# Altium schematic sheet CAN_Node.SchDoc
size A3; Author: TIMOTHY WARNOCK; CompanyName: CURTIN MOTORSPORT TEAM; DrawnBy: TIMOTHY WARNOCK; Engineer: TIMOTHY WARNOCK; Revision: 1; SheetNumber: 1; SheetTotal: 1
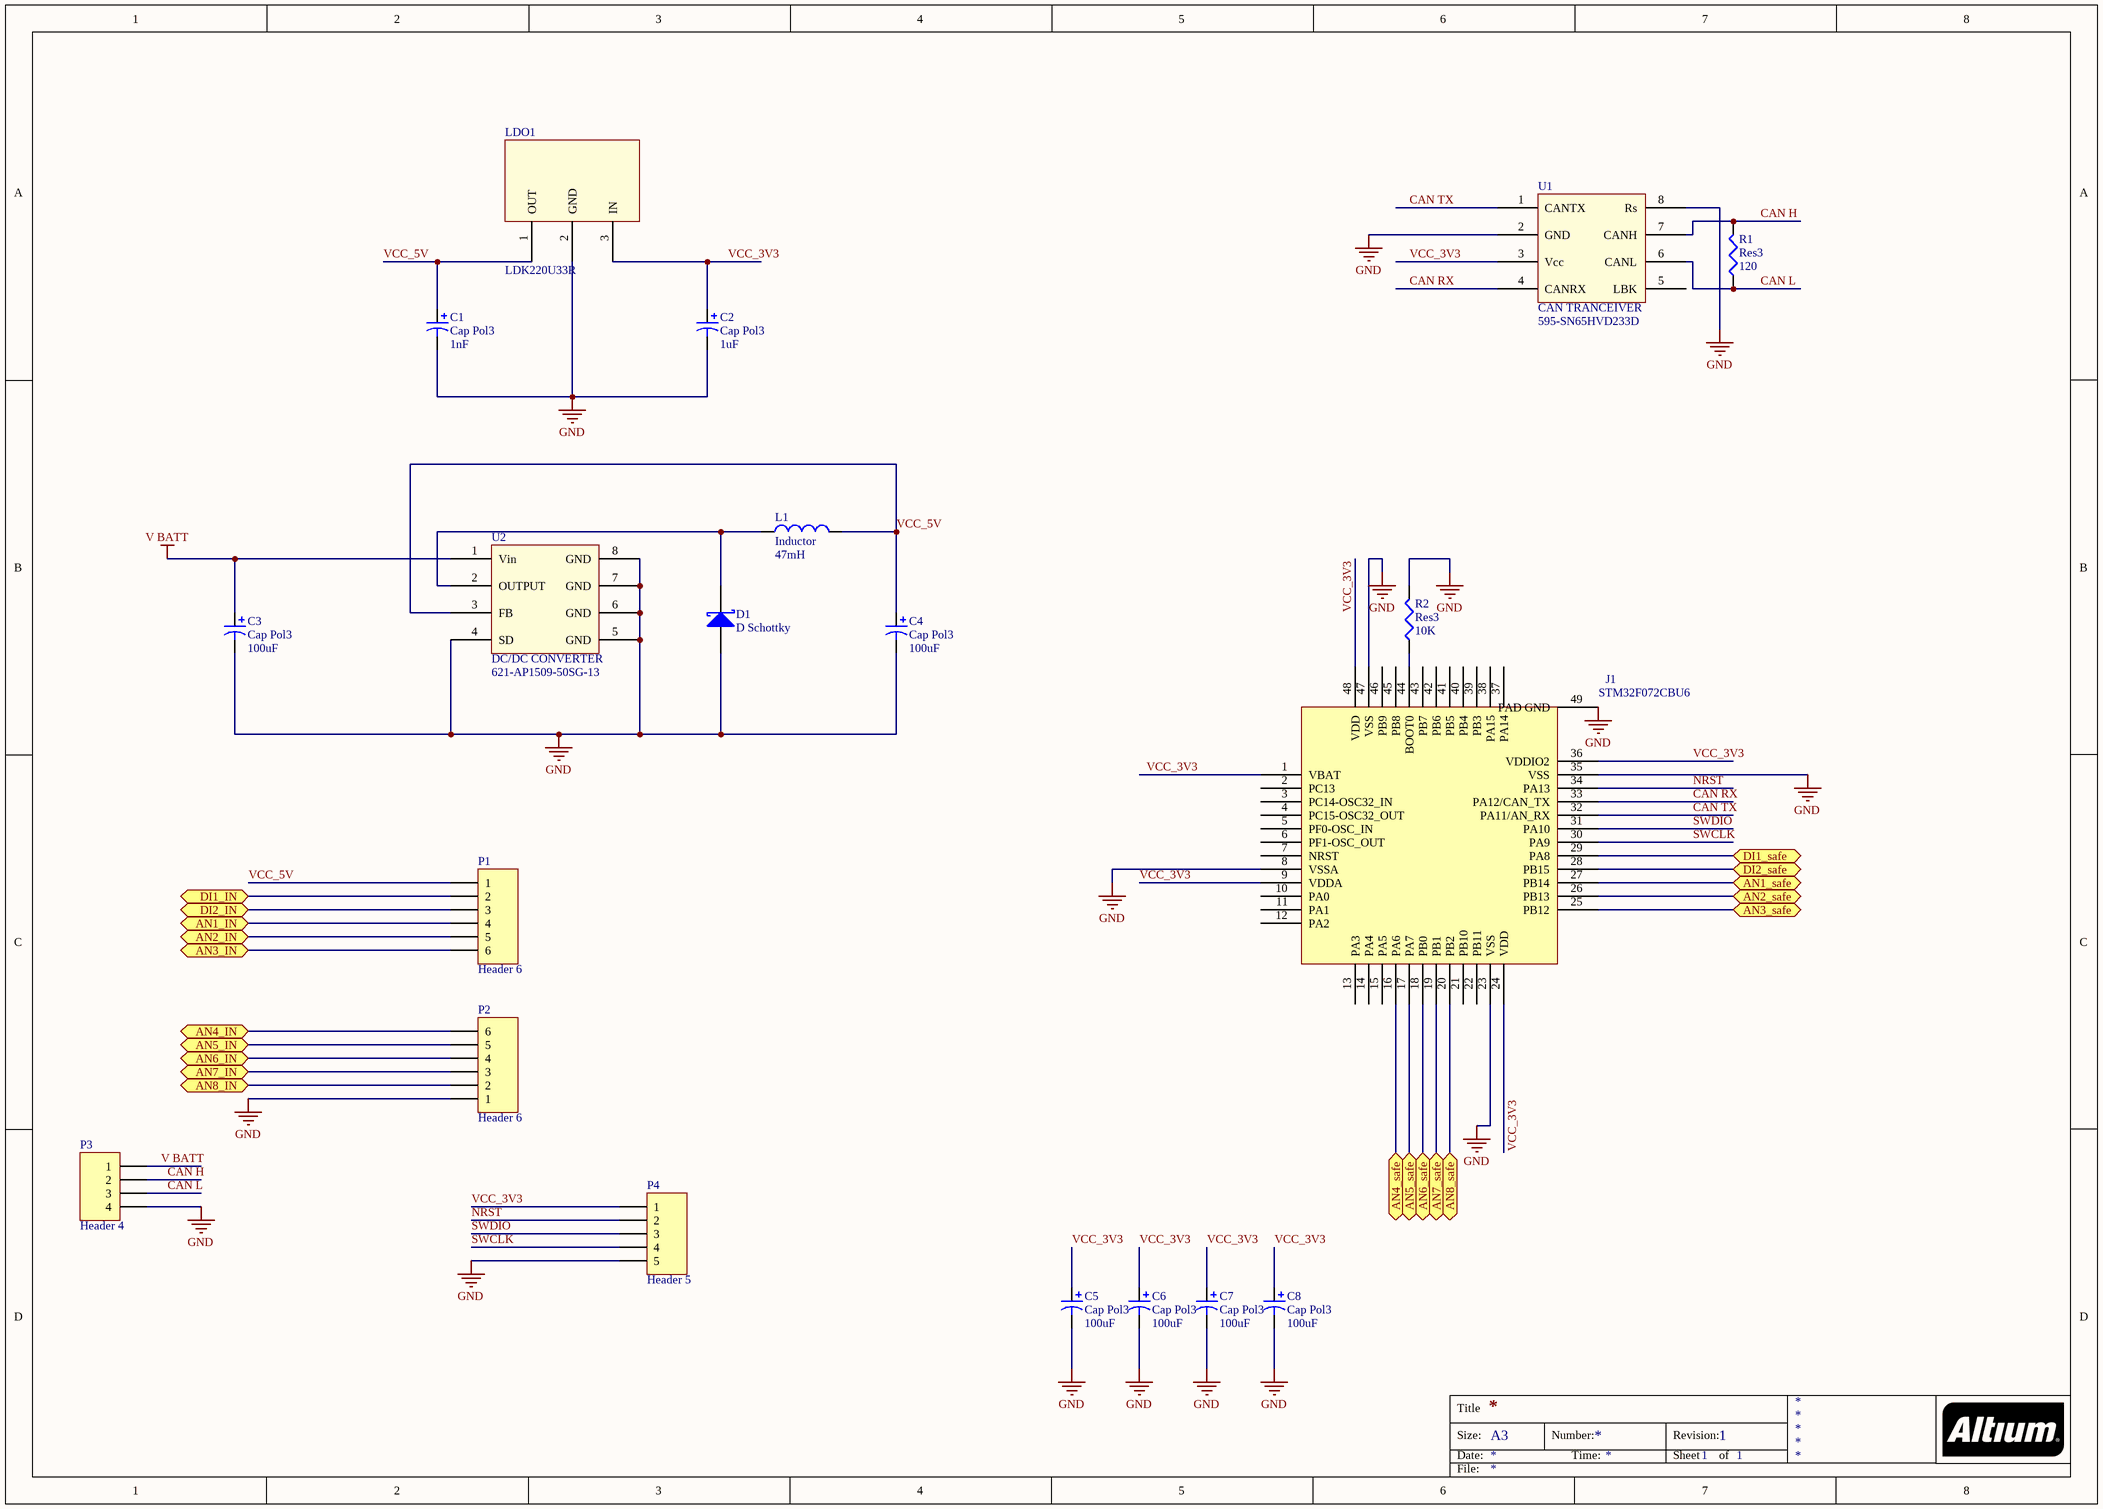
[diagram p0: CAN_Node.SchDoc]

## Parts
C1  Cap Pol3  value 1nF  [C0805]
C2  Cap Pol3  value 1uF  [C0805]
C3  Cap Pol3  value 100uF  [C0805]
C4  Cap Pol3  value 100uF  [C0805]
C5  Cap Pol3  value 100uF  [C0805]
C6  Cap Pol3  value 100uF  [C0805]
C7  Cap Pol3  value 100uF  [C0805]
C8  Cap Pol3  value 100uF  [C0805]
D1  D Schottky  [SMB]
J1  STM32F072CBU6  [STM32F072CBU6]
L1  Inductor  value 47mH  [0402-A]
LDO1  LDK220U33R  [SOT89-157P409X160-3N]
P1  Header 6  [HDR1X6]
P2  Header 6  [HDR1X6]
P3  Header 4  [HDR1X4]
P4  Header 5  [HDR1X5]
R1  Res3  value 120  [J1-0603]
R2  Res3  value 10K  [J1-0603]
U1  CAN TRANCEIVER  Supplier Part Number 1: 595-SN65HVD233D  [SOP8]
U2  DC/DC CONVERTER  Supplier Part Number 1: 621-AP1509-50SG-13  [SOP8]

## Ports
AN1_IN, AN1_safe, AN2_IN, AN2_safe, AN3_IN, AN3_safe, AN4_IN, AN4_safe, AN5_IN, AN5_safe, AN6_IN, AN6_safe, AN7_IN, AN7_safe, AN8_IN, AN8_safe, DI1_IN, DI1_safe, DI2_IN, DI2_safe

## Nets
GND: C1.2 C2.2 C3.2 C4.2 C5.2 C6.2 C7.2 C8.2 D1.1(A) J1.8(VSSA) J1.23(VSS) J1.35(VSS) J1.47(VSS) J1.49(PAD_GND) LDO1.2(GND) P2.1 P3.4 P4.5 R2.2 U1.2(GND) U1.8(Rs) U2.4(SD) U2.5(GND) U2.6(GND) U2.7(GND) U2.8(GND)
V BATT: C3.1 P3.1 U2.1(Vin)
AN1_IN: P1.4 ; port AN1_IN
AN1_safe: J1.27(PB14) ; port AN1_safe
AN2_IN: P1.5 ; port AN2_IN
AN2_safe: J1.26(PB13) ; port AN2_safe
AN3_IN: P1.6 ; port AN3_IN
AN3_safe: J1.25(PB12) ; port AN3_safe
AN4_IN: P2.6 ; port AN4_IN
AN4_safe: J1.16(PA6) ; port AN4_safe
AN5_IN: P2.5 ; port AN5_IN
AN5_safe: J1.17(PA7) ; port AN5_safe
AN6_IN: P2.4 ; port AN6_IN
AN6_safe: J1.18(PB0) ; port AN6_safe
AN7_IN: P2.3 ; port AN7_IN
AN7_safe: J1.19(PB1) ; port AN7_safe
AN8_IN: P2.2 ; port AN8_IN
AN8_safe: J1.20(PB2) ; port AN8_safe
CAN H: P3.2 R1.2 U1.7(CANH)
CAN L: P3.3 R1.1 U1.6(CANL)
CAN RX: J1.33(PA12/CAN_TX) U1.4(CANRX)
CAN TX: J1.32(PA11/AN_RX) U1.1(CANTX)
DI1_IN: P1.2 ; port DI1_IN
DI1_safe: J1.29(PA8) ; port DI1_safe
DI2_IN: P1.3 ; port DI2_IN
DI2_safe: J1.28(PB15) ; port DI2_safe
NRST: J1.34(PA13) P4.2
SWCLK: J1.30(PA9) P4.4
SWDIO: J1.31(PA10) P4.3
VCC_3V3: C2.1 C5.1 C6.1 C7.1 C8.1 J1.1(VBAT) J1.9(VDDA) J1.24(VDD) J1.36(VDDIO2) J1.48(VDD) LDO1.3(IN) P4.1 U1.3(Vcc)
VCC_5V: C1.1 C4.1 L1.2 LDO1.1(OUT) P1.1 U2.3(FB)
NetD1_2: D1.2(K) L1.1 U2.2(OUTPUT)
NetJ1_44: J1.44(BOOT0) R2.1

Not connected (* = marked no-connect by the designer): J1 2(PC13) 3(PC14-OSC32_IN) 4(PC15-OSC32_OUT) 5(PF0-OSC_IN) 6(PF1-OSC_OUT) 7(NRST) 10(PA0) 11(PA1) 12(PA2) 13(PA3) 14(PA4) 15(PA5) 21(PB10) 22(PB11) 37(PA14) 38(PA15) 39(PB3) 40(PB4) 41(PB5) 42(PB6) 43(PB7) 45(PB8) 46(PB9); U1 5(LBK)

## Notes on the sheet
- Title
- Size:
- Date:
- A3
- Number:
- Time:
- Revision:
- Sheet
- of
- File:

## Library data of the parts
C1-C8 = Cap Pol3: Polarized Capacitor (Surface Mount); Published: 8-Jun-2000; LatestRevisionDate: 29-May-2009; LatestRevisionNote: IPC-7351 Footprint Added.; PackageReference: C0805; Publisher: Altium Limited; PackageDescription: Chip Capacitor
D1 = D Schottky: Schottky Diode; Published: 8-Jun-2000; LatestRevisionDate: 17-Jul-2002; LatestRevisionNote: Re-released for DXP Platform.; PackageReference: SMB; Publisher: Altium Limited; PackageDescription: DO-214-AA/SMB; 2 C-Bend Leads; Body 5.3 x 3.6 mm, inc. leads (LxW); Code_JEDEC: DO-214-AA
J1 = STM32F072CBU6: MICROCONTROLLER
L1 = Inductor: Code_IEC: 1005; Published: 8-Jun-2000; LatestRevisionDate: 29-May-2009; LatestRevisionNote: IPC-7351 Footprint Added.; PackageReference: 0402-A; Publisher: Altium Limited; PackageDescription: Chip Inductor; Code_JEITA: 0402
LDO1 = LDK220U33R: 3.3V LDO
P1 P2 = Header 6: Header, 6-Pin; LatestRevisionDate: 17-Jul-2002; LatestRevisionNote: Re-released for DXP Platform.; Publisher: Altium Limited
P3 = Header 4: Header, 4-Pin; LatestRevisionDate: 17-Jul-2002; LatestRevisionNote: Re-released for DXP Platform.; Publisher: Altium Limited
P4 = Header 5: Header, 5-Pin; LatestRevisionDate: 17-Jul-2002; LatestRevisionNote: Re-released for DXP Platform.; Publisher: Altium Limited
R1 R2 = Res3: Resistor; Published: 8-Jun-2000; LatestRevisionDate: 29-May-2009; LatestRevisionNote: IPC-7351 Footprint Added.; PackageReference: J1-0603; Publisher: Altium Limited; PackageDescription: Chip Resistor
U1 = 595-SN65HVD233: Supplier 1: Mouser
U2 = AP1509-50SG-13: Supplier 1: Mouser